# Altium schematic sheet voltage-and-current-display-hw.SchDoc
size A4; DrawnBy: Rogério J. Marcondeli / Samuel C. Z. Fraga
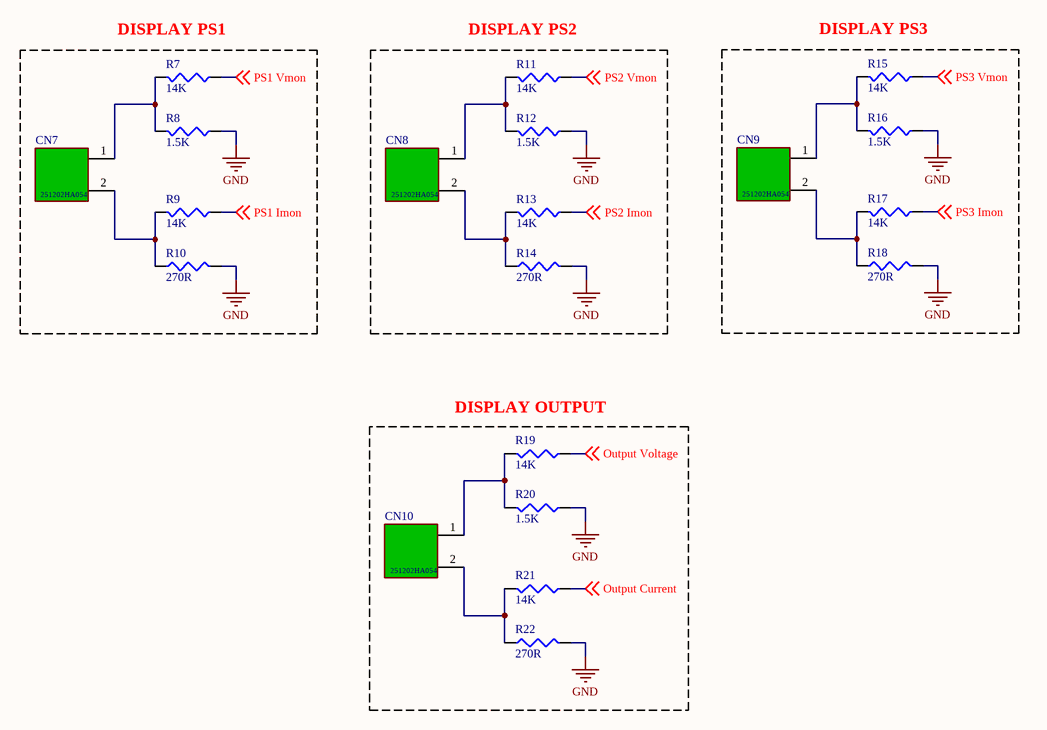
[diagram p0: voltage-and-current-display-hw.SchDoc]

## Parts
CN7  Header 2 Pin 251202HA054  [CONECTOR KK EXCON 251202HA054]  (value not drawn)
CN8  Header 2 Pin 251202HA054  [CONECTOR KK EXCON 251202HA054]  (value not drawn)
CN9  Header 2 Pin 251202HA054  [CONECTOR KK EXCON 251202HA054]  (value not drawn)
CN10  Header 2 Pin 251202HA054  [CONECTOR KK EXCON 251202HA054]  (value not drawn)
R7  14K  [R0603]
R8  1.5K  [R0603]
R9  14K  [R0603]
R10  270R  [R0603]
R11  14K  [R0603]
R12  1.5K  [R0603]
R13  14K  [R0603]
R14  270R  [R0603]
R15  14K  [R0603]
R16  1.5K  [R0603]
R17  14K  [R0603]
R18  270R  [R0603]
R19  14K  [R0603]
R20  1.5K  [R0603]
R21  14K  [R0603]
R22  270R  [R0603]

## Blocks framed on the sheet
DISPLAY PS1: CN7 R7-R10
DISPLAY PS2: CN8 R11-R14
DISPLAY PS3: CN9 R15-R18
DISPLAY OUTPUT: CN10 R19-R22

## Nets
GND: R8.1 R10.2 R12.1 R14.2 R16.1 R18.2 R20.1 R22.2
Output Current: R21.1 ; off-sheet Output Current
Output Voltage: R19.1 ; off-sheet Output Voltage
PS1 Imon: R9.1 ; off-sheet PS1 Imon
PS1 Vmon: R7.1 ; off-sheet PS1 Vmon
PS2 Imon: R13.1 ; off-sheet PS2 Imon
PS2 Vmon: R11.1 ; off-sheet PS2 Vmon
PS3 Imon: R17.1 ; off-sheet PS3 Imon
PS3 Vmon: R15.1 ; off-sheet PS3 Vmon
NetCN7_1: CN7.1 R7.2 R8.2
NetCN7_2: CN7.2 R9.2 R10.1
NetCN8_1: CN8.1 R11.2 R12.2
NetCN8_2: CN8.2 R13.2 R14.1
NetCN9_1: CN9.1 R15.2 R16.2
NetCN9_2: CN9.2 R17.2 R18.1
NetCN10_1: CN10.1 R19.2 R20.2
NetCN10_2: CN10.2 R21.2 R22.1

## Notes on the sheet
- Authors:
- Title:
- Revision:
- File:
- Project:
- Date:
- Variant:
- Sheet
- of
- DAT - INE - EMI
  Eletrônica e
  Microeletrônica
- (in symbol CONECTOR KK EXCON 251202HA054) 251202HA054

## Library data of the parts
CN7-CN10 = CONECTOR KK EXCON 251202HA054: Código LNLS: MT111636; ComponentLink1Description: https://www.excon.com.tw/images/Drawing/2512WV.pdf; ComponentLink1URL: https://www.excon.com.tw/images/Drawing/2512WV.pdf
R7 R9 R11 R13 R15 R17 R19 R21 = RESISTOR 14K: Resistor SMD 14K OHM 0.1% 1/10W 0603; Manufacturer 1: Panasonic; Manufacturer Part Number 1: ERA-3AEB1402V; Description 1: Res Thin Film 0603 14K Ohm 0.1% 1/10W ±25ppm/°C Molded SMD SMD Punched Carrier T/R; Category 1: Chip SMD Resistors; Resistance: 14kR; Temperature Coefficient: 25ppm/°C; Power Rating: 100mW; Voltage Rating: 75V; Código LNLS: AP107375; Supplier 1: Mouser; Supplier Part Number 1: 667-ERA-3AEB1402V; RoHS 1: Yes; Stock 1: 14599; Pricing 1: 1=0,31, 10=0,139, 50=0,139, 100=0,062, 1000=0,043, 10000=0,033 (USD); Mount: Surface Mount; Case/Package: 0603; Number of Pins: 2; Case Code (Metric): 1608; Case Code (Imperial): 0603; Min Operating Temperature: -55°C; Max Operating Temperature: 155°C; Tolerance: 0.1%; Resistor Type: Thin Film; Packaging: Tape and Reel; Series: ERA; Technology: METAL FILM; Resistance Tolerance: 0.1%; Length: 1.6mm; Width: 1.6mm; Height: 0.45mm; Depth: 0.8mm; ComponentLink1URL: https://datasheet.ciiva.com/11809/0900766b80eb1d8c-11809141.pdf?src-supplier=Rs; ComponentLink1Description: https://datasheet.ciiva.com/11809/0900766b80eb1d8c-11809141.pdf?src-supplier=Rs; ComponentLink2URL: https://datasheet.ciiva.com/29184/452497-da-01-en-widerstand-0603-era-29184016.pdf?src-supplier=Conrad; ComponentLink2Description: https://datasheet.ciiva.com/29184/452497-da-01-en-widerstand-0603-era-29184016.pdf?src-supplier=Conrad; ComponentLink3URL: https://datasheet.ciiva.com/9193/aoa0000ce26-9193183.pdf?src-supplier=Avnet; ComponentLink3Description: https://datasheet.ciiva.com/9193/aoa0000ce26-9193183.pdf?src-supplier=Avnet; ComponentLink4URL: https://datasheet.ciiva.com/24063/aoa0000ce26-197354-24063590.pdf?src-supplier=Mouser; ComponentLink4Description: https://datasheet.ciiva.com/24063/aoa0000ce26-197354-24063590.pdf?src-supplier=Mouser; ComponentLink5URL: https://datasheet.ciiva.com/15805/aoa0000ce26-15805493.pdf?src-supplier=Onlinecomponents.com; ComponentLink5Description: https://datasheet.ciiva.com/15805/aoa0000ce26-15805493.pdf?src-supplier=Onlinecomponents.com; ComponentLink6URL: https://datasheet.ciiva.com/5987/485442-5987128.pdf?src-supplier=Farnell; ComponentLink6Description: https://datasheet.ciiva.com/5987/485442-5987128.pdf?src-supplier=Farnell; ComponentLink7URL: https://datasheet.ciiva.com/5987/485442-5987130.pdf?src-supplier=Farnell; ComponentLink7Description: https://datasheet.ciiva.com/5987/485442-5987130.pdf?src-supplier=Farnell; ComponentLink8URL: https://datasheet.ciiva.com/5987/485442-5987131.pdf?src-supplier=Farnell; ComponentLink8Description: https://datasheet.ciiva.com/5987/485442-5987131.pdf?src-supplier=Farnell
R8 R12 R16 R20 = RESISTOR 1.5K: Resistor SMD 1.5K OHM 0.1% 1/10W 0603; Manufacturer 1: Panasonic; Manufacturer Part Number 1: ERA-3AEB152V; Description 1: Res Thin Film 0603 1.5K Ohm 0.1% 0.1W ±25ppm/°C Molded SMD Punched Carrier T/R; Category 1: Chip SMD Resistors; Resistance: 1.5kR; Temperature Coefficient: 25ppm/°C; Power Rating: 100mW; Voltage Rating: 75V; Código LNLS: MT103626; Supplier 1: Mouser; Supplier Part Number 1: 667-ERA-3AEB152V; RoHS 1: Yes; Stock 1: 5568; Pricing 1: 1=0,34, 10=0,23, 50=0,23, 100=0,094, 1000=0,05, 10000=0,036 (USD); Mount: Surface Mount; Case/Package: 0603; Number of Pins: 2; Contact Plating: Tin; Case Code (Metric): 1608; Case Code (Imperial): 0603; Size Code: 0603; Min Operating Temperature: -55°C; Max Operating Temperature: 155°C; Tolerance: 0.1%; Resistor Type: Thin Film; Packaging: Tape and Reel; Package Quantity: 1; Number of Terminations: 2; Termination: SMD/SMT; Max Power Dissipation: 100mW; Voltage Rating (DC): 75V; Features: Automotive AEC-Q200; Series: ERA-3A; Resistance Tolerance: 0.1%; Technology: METAL FILM; Length: 1.6mm; Width: 0.8mm; Height: 0.45mm; Depth: 0.8mm; Ratings: AEC-Q200; Radiation Hardening: No; Reach SVHC Compliant: No; Lead Free: Lead Free; RoHS Compliant: Yes; ComponentLink1URL: https://datasheet.ciiva.com/11811/0900766b80beefcc-11811712.pdf?src-supplier=Rs; ComponentLink1Description: https://datasheet.ciiva.com/11811/0900766b80beefcc-11811712.pdf?src-supplier=Rs; ComponentLink2URL: https://datasheet.ciiva.com/29183/450830-da-01-en-widerstand-0603-era-29183764.pdf?src-supplier=Conrad; ComponentLink2Description: https://datasheet.ciiva.com/29183/450830-da-01-en-widerstand-0603-era-29183764.pdf?src-supplier=Conrad; ComponentLink3URL: https://datasheet.ciiva.com/9117/aoa0000ce26-9117365.pdf?src-supplier=Avnet; ComponentLink3Description: https://datasheet.ciiva.com/9117/aoa0000ce26-9117365.pdf?src-supplier=Avnet; ComponentLink4URL: https://datasheet.ciiva.com/5734/485442-5734538.pdf?src-supplier=Farnell; ComponentLink4Description: https://datasheet.ciiva.com/5734/485442-5734538.pdf?src-supplier=Farnell; ComponentLink5URL: https://datasheet.ciiva.com/5734/485442-5734539.pdf?src-supplier=Farnell; ComponentLink5Description: https://datasheet.ciiva.com/5734/485442-5734539.pdf?src-supplier=Farnell; ComponentLink6URL: https://datasheet.ciiva.com/46422/485442-46422565.pdf?src-supplier=Element14; ComponentLink6Description: https://datasheet.ciiva.com/46422/485442-46422565.pdf?src-supplier=Element14; ComponentLink7URL: https://datasheet.ciiva.com/16760/70068849-16760629.pdf?src-supplier=Allied+Electronics; ComponentLink7Description: https://datasheet.ciiva.com/16760/70068849-16760629.pdf?src-supplier=Allied+Electronics; ComponentLink8URL: https://datasheet.ciiva.com/7830/485442-7830591.pdf?src-supplier=Element14; ComponentLink8Description: https://datasheet.ciiva.com/7830/485442-7830591.pdf?src-supplier=Element14; ComponentLink9URL: https://datasheet.ciiva.com/28513/485442-28513834.pdf?src-supplier=Element14; ComponentLink9Description: https://datasheet.ciiva.com/28513/485442-28513834.pdf?src-supplier=Element14; ComponentLink10URL: https://datasheet.ciiva.com/30146/54aoa0000ce26-30146117.pdf?src-supplier=Onlinecomponents.com; ComponentLink10Description: https://datasheet.ciiva.com/30146/54aoa0000ce26-30146117.pdf?src-supplier=Onlinecomponents.com; ComponentLink11URL: https://datasheet.ciiva.com/48530/era-eng-tds-48530507.pdf?src-supplier=Distrelec; ComponentLink11Description: https://datasheet.ciiva.com/48530/era-eng-tds-48530507.pdf?src-supplier=Distrelec
R10 R14 R18 R22 = RESISTOR 270R: Resistor SMD 270 OHM 1% 1/10W 0603; Manufacturer 1: Vishay Dale; Manufacturer Part Number 1: CRCW0603270RFKEAC; Description 1: Res Thick Film 0603 270 Ohm 1% 0.1W(1/10W) ±100ppm/C Pad SMD T/R; Category 1: Chip SMD Resistors; Max Power Dissipation: 100mW; Temperature Coefficient: 100ppm/°C; Código LNLS: AP100898; Supplier 1: Mouser; Supplier Part Number 1: 71-CRCW0603270RFKEAC; RoHS 1: Yes; Stock 1: 68500; Pricing 1: 1=0,1, 10=0,016, 50=0,016, 100=0,009, 1000=0,006, 10000=0,004 (USD); Case/Package: 0603; Min Operating Temperature: -55°C; Max Operating Temperature: 155°C; Packaging: Tape and Reel; Resistance: 270R; Tolerance: 1%; Number of Terminations: 2; Series: CRCW-C; RoHS Compliant: Yes; ComponentLink1URL: http://www.vishay.com/docs/28773/crcwce3.pdf?src-supplier=Digi-Key; ComponentLink1Description: http://www.vishay.com/docs/28773/crcwce3.pdf?src-supplier=Digi-Key; ComponentLink2URL: https://datasheet.octopart.com/CRCW0603270RFKEAC-Vishay-datasheet-102570912.pdf?src-supplier=Future+Electronics; ComponentLink2Description: https://datasheet.octopart.com/CRCW0603270RFKEAC-Vishay-datasheet-102570912.pdf?src-supplier=Future+Electronics